# Altium project DE-100224.PrjPcb
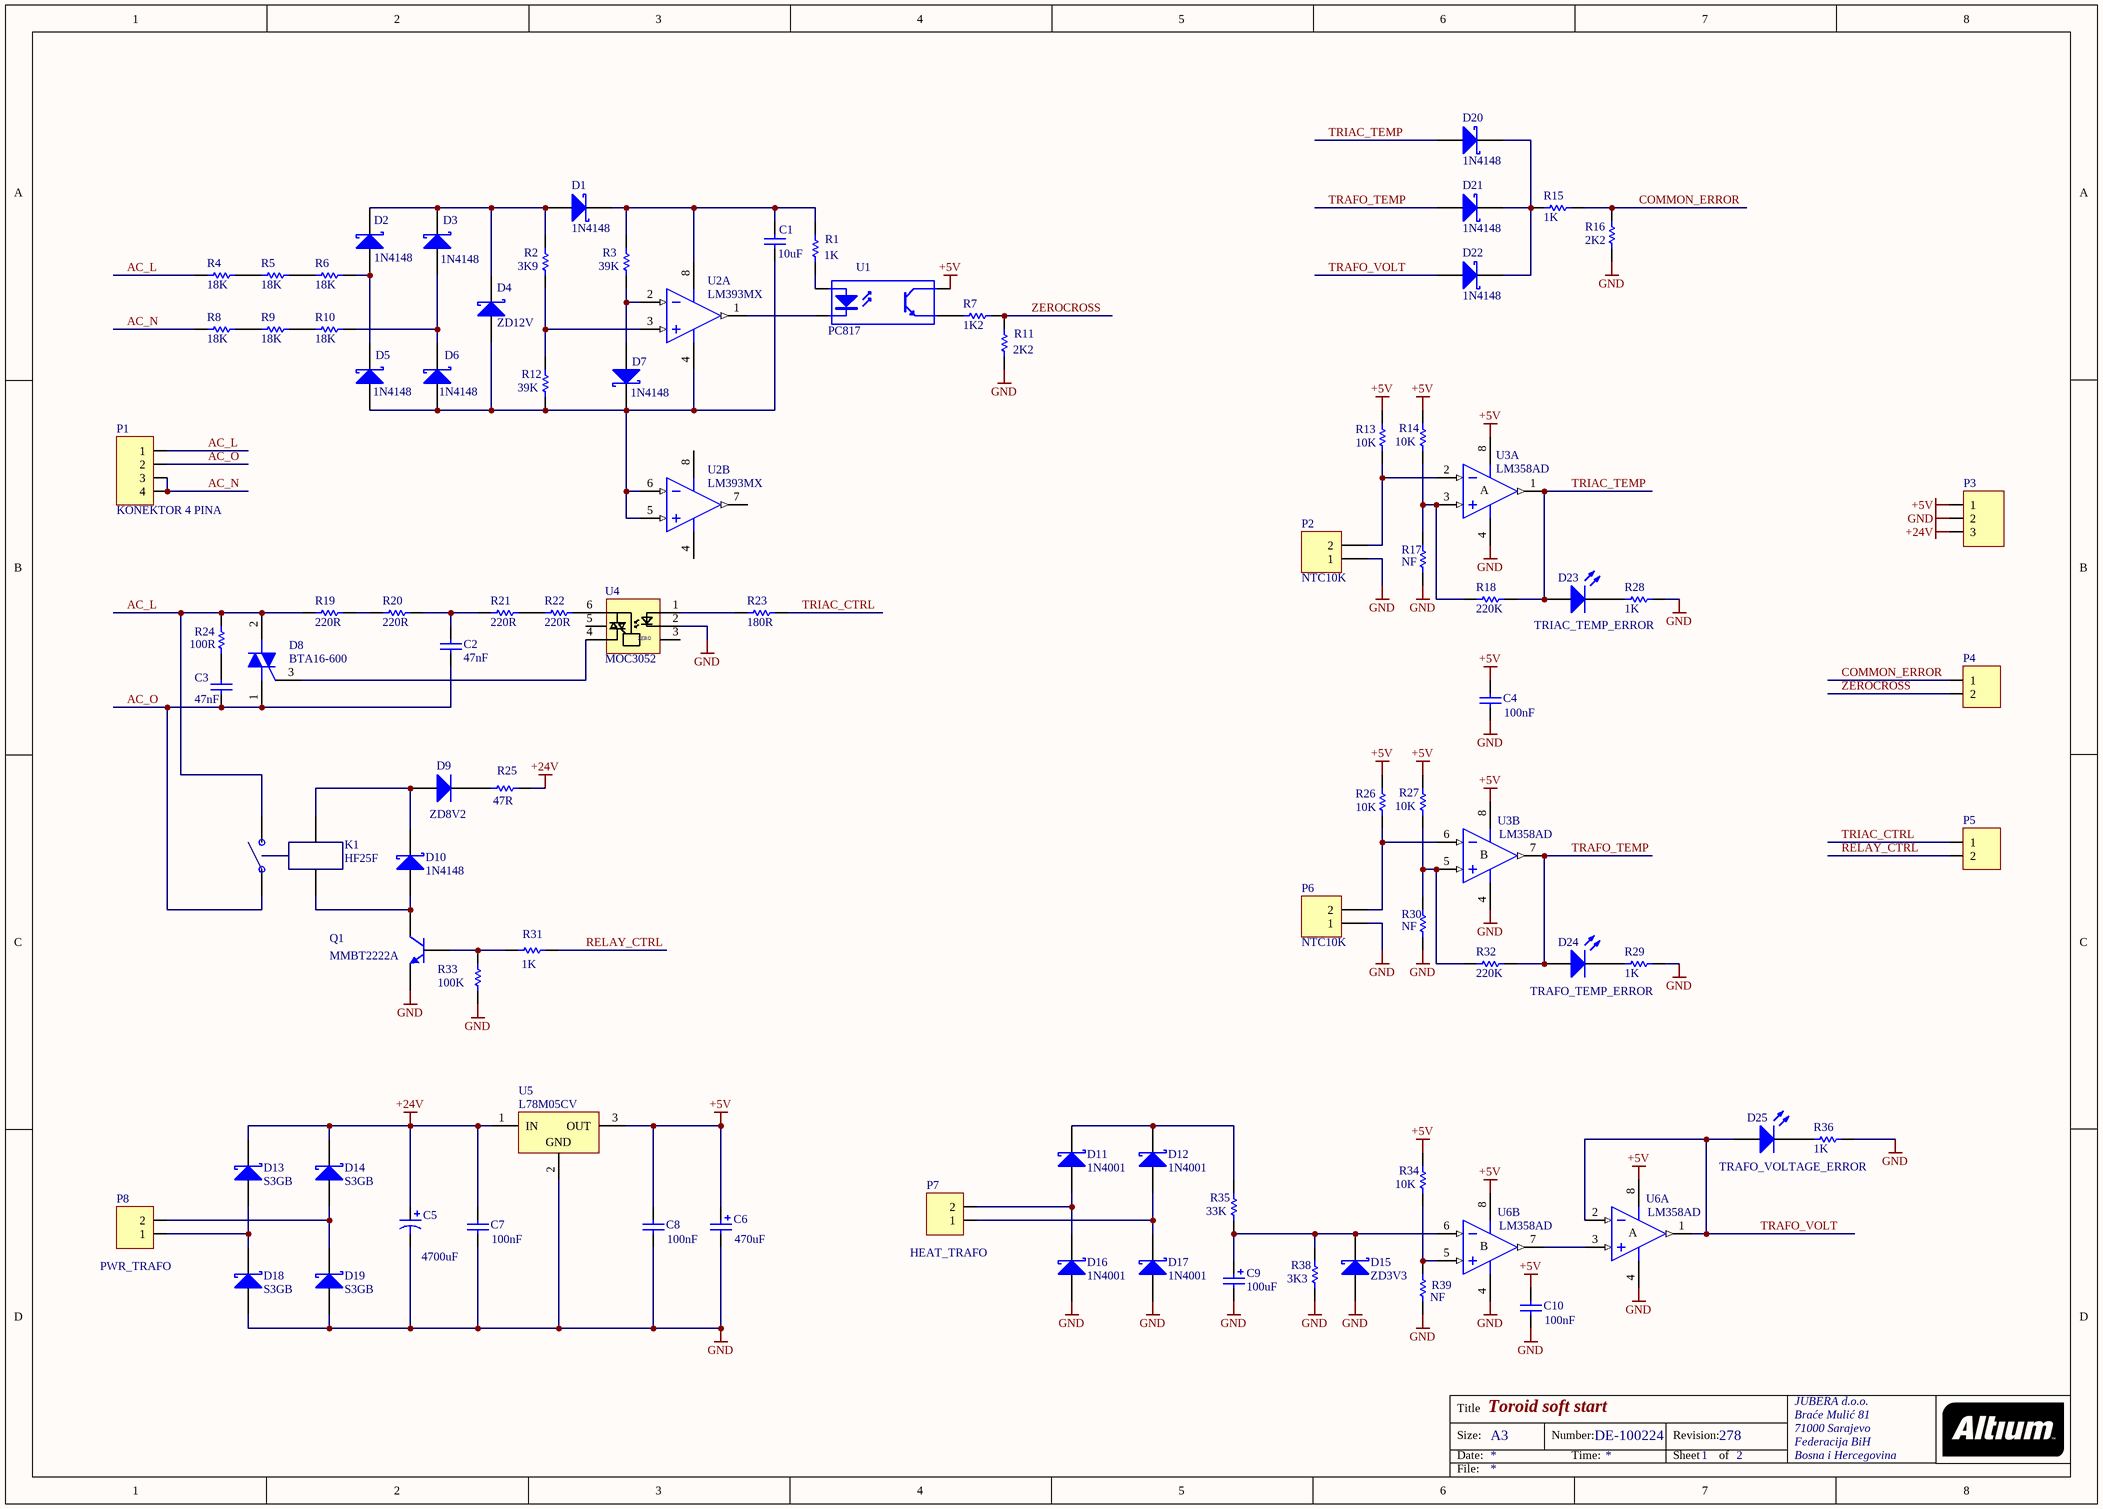
[diagram p0: DE-100224_01.SchDoc]
1 sheet, 89 parts. Net scope: global (net labels, ports and power ports of the same name join across sheets).
Board file: DE-100224.PcbDoc

## Sheet DE-100224_01.SchDoc: Toroid soft start
size A3; Author: eldar6776@hotmail.com; DrawnBy: Eldar Dedic; Organization: JUBERA d.o.o.; Address1: Braće Mulić 81; Address2: 71000 Sarajevo; Address3: Federacija BiH; Address4: Bosna i Hercegovina; DocumentNumber: DE-100224; Revision: 278; SheetNumber: 1; SheetTotal: 2

### Parts
C1  10uF  [0805]
C2  47nF  [X2 CAP]
C3  47nF  [X2 CAP]
C4  100nF  [0603]
C5  4700uF  [CAPPR5-13X25]
C6  470uF  [CAPPR5-10X16]
C7  100nF  [0603]
C8  100nF  [0603]
C9  100uF  [CAPPR2-5X11]
C10  100nF  [0603]
D1  1N4148  [SOD323]
D2  1N4148  [SOD323]
D3  1N4148  [SOD323]
D4  ZD12V  [SMB]
D5  1N4148  [SOD323]
D6  1N4148  [SOD323]
D7  1N4148  [SOD323]
D8  BTA16-600  [ONSC-TO-220-3-221A-07]
D9  ZD8V2  [DO-41]
D10  1N4148  [SOD323]
D11  1N4001  [SMB]
D12  1N4001  [SMB]
D13  S3GB  [SMB]
D14  S3GB  [SMB]
D15  ZD3V3  [SOD323]
D16  1N4001  [SMB]
D17  1N4001  [SMB]
D18  S3GB  [SMB]
D19  S3GB  [SMB]
D20  1N4148  [SOD323]
D21  1N4148  [SOD323]
D22  1N4148  [SOD323]
D23  TRIAC_TEMP_ERROR  [1.6X0.8X0.8]
D24  TRAFO_TEMP_ERROR  [1.6X0.8X0.8]
D25  TRAFO_VOLTAGE_ERROR  [1.6X0.8X0.8]
K1  HF25F  [HF25F]
P1  KONEKTOR 4 PINA  [KONEKTOR 4 PINA]
P2  NTC10K  [HDR1X2]
P3  (no value)  [TERMINAL BLOK 3]
P4  (no value)  [TERMINAL BLOK 2]
P5  (no value)  [TERMINAL BLOK 2]
P6  NTC10K  [HDR1X2]
P7  HEAT_TRAFO  [KONEKTOR 2 PINA]
P8  PWR_TRAFO  [KONEKTOR 2 PINA]
Q1  MMBT2222A  [SOT23_N]
R1  1K  [ERA-0603]
R2  3K9  [ERA-0603]
R3  39K  [ERA-0603]
R4  18K  [ERA-0805]
R5  18K  [ERA-0805]
R6  18K  [ERA-0805]
R7  1K2  [ERA-0603]
R8  18K  [ERA-0805]
R9  18K  [ERA-0805]
R10  18K  [ERA-0805]
R11  2K2  [ERA-0603]
R12  39K  [ERA-0603]
R13  10K  [ERA-0603]
R14  10K  [ERA-0603]
R15  1K  [ERA-0603]
R16  2K2  [ERA-0603]
R17  NF  [ERA-0603]
R18  220K  [ERA-0603]
R19  220R  [ERA-0805]
R20  220R  [ERA-0805]
R21  220R  [ERA-0805]
R22  220R  [ERA-0805]
R23  180R  [ERA-0603]
R24  100R  [1W100R]
R25  value 47R  [AXIAL-0.3]  (hidden comment: Res1)
R26  10K  [ERA-0603]
R27  10K  [ERA-0603]
R28  1K  [ERA-0603]
R29  1K  [ERA-0603]
R30  NF  [ERA-0603]
R31  1K  [ERA-0603]
R32  220K  [ERA-0603]
R33  100K  [ERA-0603]
R34  10K  [ERA-0603]
R35  33K  [ERA-0603]
R36  1K  [ERA-0603]
R38  3K3  [ERA-0603]
R39  NF  [ERA-0603]
U1  PC817  [DIP-4]
U2  LM393MX  [M08A_N]  (parts A,B of 2)
U3  LM358AD  [SO8_N]  (parts A,B of 2)
U4  MOC3052  [DIP6]
U5  L78M05CV  [TO220]
U6  LM358AD  [SO8_N]  (parts A,B of 2)

### Nets
+5V: C4.2 C6.1 C8.2 C10.2 P3.1 R13.2 R14.2 R26.2 R27.2 R34.2 U1.4(C) U3.8(V+) U5.3(OUT) U6.8(V+)
+24V: C5.1 C7.2 D13.2(K) D14.2(K) P3.3 R25.2 U5.1(IN)
GND: C4.1 C5.2 C6.2 C7.1 C8.1 C9.2 C10.1 D15.2(A) D16.1(A) D17.1(A) D18.1(A) D19.1(A) P2.1 P3.2 P6.1 Q1.2(E) R11.1 R16.1 R17.1 R28.1 R29.1 R30.1 R33.1 R36.1 R38.1 R39.1 U3.4(V-) U4.2 U5.2(GND) U6.4(V-)
AC_L: D8.2(MT2) K1.4 P1.1 R4.1 R19.1 R24.2
AC_N: P1.3 P1.4 R8.1
AC_O: C2.1 C3.1 D8.1(MT1) K1.3 P1.2
COMMON_ERROR: P4.1 R15.1 R16.2
RELAY_CTRL: P5.2 R31.1
TRAFO_TEMP: D21.2(A) D24.1(A) R32.1 U3.7(OUT)
TRAFO_VOLT: D22.2(A) D25.1(A) U6.1(OUT) U6.2(IN-)
TRIAC_CTRL: P5.1 R23.1
TRIAC_TEMP: D20.2(A) D23.1(A) R18.1 U3.1(OUT)
ZEROCROSS: P4.2 R7.1 R11.2
NetC1_1: C1.1 D4.1(A) D5.2(A) D6.2(A) D7.1(K) R12.1 U2.4(GND) U2.5(INB+) U2.6(INB-)
NetC1_2: C1.2 D1.1(K) R1.2 R3.2 U2.8(V+)
NetC2_2: C2.2 R20.2 R21.1
NetC3_2: C3.2 R24.1
NetC9_1: C9.1 D15.1(K) R35.1 R38.2 U6.6(IN-)
NetD1_2: D1.2(A) D2.1(K) D3.1(K) D4.2(K) R2.2
NetD2_2: D2.2(A) D5.1(K) R6.2
NetD3_2: D3.2(A) D6.1(K) R10.2
NetD7_2: D7.2(A) R3.1 U2.2(INA-)
NetD8_3: D8.3(G) U4.4
NetD9_1: D9.1(A) D10.1(K) K1.2
NetD9_2: D9.2(K) R25.1
NetD10_2: D10.2(A) K1.1 Q1.3(C)
NetD11_1: D11.1(A) D16.2(K) P7.2
NetD11_2: D11.2(K) D12.2(K) R35.2
NetD12_1: D12.1(A) D17.2(K) P7.1
NetD13_1: D13.1(A) D18.2(K) P8.1
NetD14_1: D14.1(A) D19.2(K) P8.2
NetD20_1: D20.1(K) D21.1(K) D22.1(K) R15.2
NetD23_2: D23.2(K) R28.2
NetD24_2: D24.2(K) R29.2
NetD25_2: D25.2(K) R36.2
NetP2_2: P2.2 R13.1 U3.2(IN-)
NetP6_2: P6.2 R26.1 U3.6(IN-)
NetQ1_1: Q1.1(B) R31.2 R33.2
NetR1_1: R1.1 U1.1(A)
NetR2_1: R2.1 R12.2 U2.3(INA+)
NetR4_2: R4.2 R5.1
NetR5_2: R5.2 R6.1
NetR7_2: R7.2 U1.3(E)
NetR8_2: R8.2 R9.1
NetR9_2: R9.2 R10.1
NetR14_1: R14.1 R17.2 R18.2 U3.3(IN+)
NetR19_2: R19.2 R20.1
NetR21_2: R21.2 R22.1
NetR22_2: R22.2 U4.6
NetR23_2: R23.2 U4.1
NetR27_1: R27.1 R30.2 R32.2 U3.5(IN+)
NetR34_1: R34.1 R39.2 U6.5(IN+)
NetU1_2: U1.2(K) U2.1(OUTA)
NetU6_3: U6.3(IN+) U6.7(OUT)

Not connected (* = marked no-connect by the designer): U2 7(OUTB); U4 3 5

### Notes on the sheet
- Title
- Size:
- Date:
- A3
- Number:
- Time:
- Revision:
- Sheet
- of
- File:
- (in symbol LM358AD, part A) A
- (in symbol LM358AD, part B) B
- (in symbol MOC3081) ZERO

### Library data of the parts
C1 = C0805: Ceramic Chip Capacitor - Standard; Note: Footprint corresponds to dimensions for bulk cassette packaging. This case size has tightened tolerances.; Published: 17-Jul-2002; LatestRevisionDate: 19-Mar-2004; LatestRevisionNote: Silkscreen size reduced.; DatasheetDocument: Mar-2001; PackageDocument: Mar-2001; PackageReference: 0805; Publisher: Altium Limited; Code_JEITA: 0805; Code_IPC: 2012[0805]; ComponentLink1Description: Manufacturer Link; ComponentLink1URL: http://www.kemet.com/; ComponentLink2Description: Datasheet; ComponentLink2URL: http://www.kemet.com/kemet/web/homepage/kechome.nsf/vapubfilesname/F3102TA.pdf/$file/F3102TA.pdf; Value: 10uF
C2 C3 = CAP X2: X2 275VAC capaitor
C4 C7 C8 C10 = C0603: Ceramic Chip Capacitor - Standard; Note: Footprint corresponds to dimensions for bulk cassette packaging. This case size has tightened tolerances.; Published: 17-Jul-2002; LatestRevisionDate: 19-Mar-2004; LatestRevisionNote: Silkscreen size reduced.; DatasheetDocument: Mar-2001; PackageDocument: Mar-2001; PackageReference: 0603; Publisher: Altium Limited; Code_JEITA: 0603; Code_IPC: 1608 [0603]; ComponentLink1Description: Manufacturer Link; ComponentLink1URL: http://www.kemet.com/; ComponentLink2Description: Datasheet; ComponentLink2URL: http://www.kemet.com/kemet/web/homepage/kechome.nsf/vapubfilesname/F3102TA.pdf/$file/F3102TA.pdf; Value: 100nF
C5 = EKA00GG447C00: Aluminum Electrolytic Capacitor, Radial Style with Long Leads: 4700uF, 10V; Note: Refer to Manufacturer's Data Sheets for other lead formations; DrillSize: Nominal, Rounded To The Nearest 0.1mm; Published: 19-Mar-2004; DatasheetDocument: 20-Feb-2001; PackageReference: CAPPR5-13X25; Publisher: Altium Limited; ComponentLink1Description: Manufacturer Link; ComponentLink1URL: http://www.vishay.com/; ComponentLink2Description: Datasheet; ComponentLink2URL: http://www.vishay.com/docs/25014/eka.pdf; Value: 4700uF
C6 = EKA00DD347F00: Aluminum Electrolytic Capacitor, Radial Style with Long Leads: 470uF, 35V; Note: Refer to Manufacturer's Data Sheets for other lead formations; DrillSize: Nominal, Rounded To The Nearest 0.1mm; Published: 19-Mar-2004; DatasheetDocument: 20-Feb-2001; PackageReference: CAPPR5-10X16; Publisher: Altium Limited; ComponentLink1Description: Manufacturer Link; ComponentLink1URL: http://www.vishay.com/; ComponentLink2Description: Datasheet; ComponentLink2URL: http://www.vishay.com/docs/25014/eka.pdf; Value: 470uF
C9 = EKA00AA247F00: Aluminum Electrolytic Capacitor, Radial Style with Long Leads: 47uF, 35V; Note: Refer to Manufacturer's Data Sheets for other lead formations; DrillSize: Nominal, Rounded To The Nearest 0.1mm; Published: 19-Mar-2004; DatasheetDocument: 20-Feb-2001; PackageReference: CAPPR2-5X11; Publisher: Altium Limited; ComponentLink1Description: Manufacturer Link; ComponentLink1URL: http://www.vishay.com/; ComponentLink2Description: Datasheet; ComponentLink2URL: http://www.vishay.com/docs/25014/eka.pdf; Value: 47uF
D1-D3 D5-D7 D10 D15 D20-D22 = 1PS76SB10: Schottky Barrier Diode; Published: 17-Sep-2003; LatestRevisionDate: 19-Mar-2004; LatestRevisionNote: Silkscreen size reduced.; DatasheetVersion: 14-Oct-1996; PackageVersion: May-1999; PackageReference: SOD323; Publisher: Altium Limited; PackageDescription: SOD-323/SC-76; 2 Leads; Body 1.7 x 1.3 mm, (LxW); ComponentLink1Description: Manufacturer Link; ComponentLink1URL: http://www.semiconductors.philips.com/; ComponentLink2Description: Datasheet; ComponentLink2URL: http://www.semiconductors.philips.com/acrobat/datasheets/1PS76SB10_2.pdf
D4 = 10BQ100: Schottky Rectifier; Published: 8-Jun-2000; LatestRevisionDate: 17-Jul-2002; LatestRevisionNote: Re-released for DXP Platform.; DatasheetVersion: PD-2.437A; PackageReference: SMB; Publisher: Altium Limited; PackageDescription: DO-214-AA/SMB; 2 C-Bend Leads; Body 5.3 x 3.6 mm, inc. leads (LxW); ComponentLink1Description: Manufacturer Link; ComponentLink1URL: http://www.irf.com/; ComponentLink2Description: Datasheet; ComponentLink2URL: http://www.irf.com/product-info/datasheets/data/10bq100.pdf
D8 = BTA08-600BW3G: Triacs, Silicon Bidirectional Thyristor, 3-Pin TO-220, Pb-Free, Tube; Manufacturer: On Semiconductor; IGT Max (mA): 50; IT(RMS) Max (A): 8; ITSM Max (A): 90; DatasheetVersion: Rev. 1; PackageVersion: Rev. O, 07/2008; PackageReference: TO-220-3-221A-07; PackageDescription: 3-Pin Flange Mount, Vertical Straight Lead, Body 9.97 x 4.445 mm, Pitch 2.54 mm; Supplier 1: Digi-Key; Supplier Part Number 1: BTA08-600BW3G-ND; Supplier 2: Newark; Supplier Part Number 2: 13P2072; Supplier 3: Mouser; Supplier Part Number 3: 863-BTA08-600BW3G; Packing: Tube; RoHS: Pb-Free; Mounting Technology: Through Hole; PartNumber: BTA08-600BW3G; ComponentLink1Description: Manufacturer URL; ComponentLink1URL: http://www.onsemi.com/; ComponentLink2Description: Datasheet; ComponentLink2URL: http://www.onsemi.com/pub_link/Collateral/BTA08-600BW3-D.PDF; ComponentLink3Description: Package Specification; ComponentLink3URL: http://www.onsemi.com/pub_link/Collateral/221A-07.PDF
D9 = 1N4003: 1.0 Ampere General Purpose Rectifier; Published: 8-Jun-2000; LatestRevisionDate: 17-Jul-2002; LatestRevisionNote: Re-released for DXP Platform.; DatasheetDocument: 1998; PackageDocument: Aug-1999; PackageReference: DO-41; Publisher: Altium Limited; Code_JEDEC: DO-204-AL; ComponentLink1Description: Manufacturer Link; ComponentLink1URL: http://www.fairchildsemi.com/; ComponentLink2Description: Pinout Specification; ComponentLink2URL: http://www.fairchildsemi.com/ds/1N%2F1N4001.pdf
D11-D14 D16-D19 = D Schottky: Schottky Diode; Published: 8-Jun-2000; LatestRevisionDate: 17-Jul-2002; LatestRevisionNote: Re-released for DXP Platform.; PackageReference: SMB; Publisher: Altium Limited; PackageDescription: DO-214-AA/SMB; 2 C-Bend Leads; Body 5.3 x 3.6 mm, inc. leads (LxW); Code_JEDEC: DO-214-AA
D23-D25 = HSMB-C190: Blue Surface Mount Chip LED, Blue; LuminousIntensity: 1.6mcd (Minimum).; PCB_Layout: Complies with manufacturer's recommendation.; Published: 11-Dec-2002; DatasheetVersion: 26-Feb-2002; PackageVersion: Mar-2002; PackageReference: 1.6X0.8X0.8; Publisher: Altium Limited; PackageDescription: SM LED; 2 Flat Leads; LED_Colour: Blue; ComponentLink1Description: Manufacturer Link; ComponentLink1URL: http://www.avagotech.com/; ComponentLink2Description: Datasheet; ComponentLink2URL: http://cp.literature.agilent.com/litweb/pdf/5988-5211EN.pdf
K1 = HF25F: PCB relay 250VAC/20A 30VDC/16A
P1 = KONEKTOR 4 PINA: Razdvojivi konektor 4 pina
P2 P6 = Header 2: Header, 2-Pin; LatestRevisionDate: 17-Jul-2002; LatestRevisionNote: Re-released for DXP Platform.; Publisher: Altium Limited
P3 = TERMINAL BLOK 3: 3 pinski terminal blok konektor
P4 P5 = TERMINAL BLOK 2: Terminal blok konektor 3,5 mm
P7 P8 = KONEKTOR 2 PINA: Razdvojivi konetor 2 pina
Q1 = BC817: NPN General-purpose Transistor; Published: 17-Sep-2003; LatestRevisionDate: 12-Dec-2006; LatestRevisionNote: IPC-7351 Footprint Added.; DatasheetVersion: Jun-1999; PackageVersion: May-1999; PackageReference: SOT23; Publisher: Altium Limited; PackageDescription: 3-Pin SOT-23 Package 0.95 mm Pitch, 2.3 mm Lead Span; ComponentLink1Description: Manufacturer Link; ComponentLink1URL: http://www.semiconductors.philips.com/; ComponentLink2Description: Datasheet; ComponentLink2URL: http://www.semiconductors.philips.com/acrobat/datasheets/BC817_BC817W_BC337_5.pdf
R1-R3 R7 R11-R18 R23 R26-R36 R38 R39 = ERAV: Metal Film Thermosensitive Chip Resistor, 0.56 Ohm to 10k Ohm Range, 5% Tolerance, 0603 Size, 0.063 W; Note: If flow soldering, adjust pad width of PCB Footprint to 0.7 - 0.8 times the width of the resistor.; Published: 17-Dec-2003; LatestRevisionDate: 19-Mar-2004; LatestRevisionNote: Silkscreen size reduced.; PackageDocument: Mar-2003; PackageReference: ERA-0603; Publisher: Altium Limited; Code_IPC: 1608 [0603]; ComponentLink1Description: Manufacturer Link; ComponentLink1URL: http://www.panasonic.com/industrial/components/resistive_products.htm; ComponentLink2Description: Datasheet; ComponentLink2URL: http://www.panasonic.com/industrial/components/pdf/AOF0000CE1.pdf
R4-R6 R8-R10 R19-R22 = ERAS: Metal Film Thermosensitive Chip Resistor, 0.56 Ohm to 10k Ohm Range, 5% Tolerance, 0805 Size, 0.1 W; Note: If flow soldering, adjust pad width of PCB Footprint to 0.7 - 0.8 times the width of the resistor.; Published: 17-Dec-2003; LatestRevisionDate: 19-Mar-2004; LatestRevisionNote: Silkscreen size reduced.; PackageDocument: Mar-2003; PackageReference: ERA-0805; Publisher: Altium Limited; Code_IPC: 2012 [0805]; ComponentLink1Description: Manufacturer Link; ComponentLink1URL: http://www.panasonic.com/industrial/components/resistive_products.htm; ComponentLink2Description: Datasheet; ComponentLink2URL: http://www.panasonic.com/industrial/components/pdf/AOF0000CE1.pdf
R24 = 1W100R: Carbon F 1W resistor; Published: 17-Dec-2003; PackageReference: RD6.35x2.3; Publisher: Altium Limited; ComponentLink1Description: Manufacturer Link; ComponentLink1URL: http://www.panasonic.com/industrial/components/resistive_products.htm; ComponentLink2Description: Datasheet; ComponentLink2URL: http://www.panasonic.com/industrial/components/pdf/AOA0000CE12.pdf
R25 = Res1: Resistor; Published: 8-Jun-2000; LatestRevisionDate: 17-Jul-2002; LatestRevisionNote: Re-released for DXP Platform.; PackageReference: AXIAL-0.3; Publisher: Altium Limited; PackageDescription: Axial Device, Thru-Hole; 2 Leads; 0.3 in Pin Spacing
U1 = PC817: 4-Pin Phototransistor Optocoupler; Published: 24-Mar-1999; LatestRevisionDate: 04-Mar-2005; LatestRevisionNote: Sch pins 3 & 4 Swapped.; DatasheetVersion: Nov-2003; PackageReference: DIP-4; Publisher: Altium Limited
U2 = LM393MX: Low Power Low Offset Voltage Dual Comparator, 8-pin Narrow SOIC; Manufacturer: National Semiconductor; PackageTopMarking: NSZXTT*LM*393M; PowerWise: N; High-Reliability: Y; DatasheetVersion: Aug-2002; PackageVersion: revM, May-2009; PackageReference: M08A; PackageDescription: SOIC Narrow, 4.9 x 3.9 x 1.45mm, 8 Lead, 1.27mm Pitch; PartNumber: LM393MX; RoHS: N; PinCount: 8; CompType: Comparator; Code_JEDEC: MS-012-AA; Code_IPC: SOIC127P600-8; ComponentLink1Description: Manufacturer URL; ComponentLink1URL: http://www.national.com/; ComponentLink2Description: LM393 Datasheet; ComponentLink2URL: http://www.national.com/ds/LM/LM393.pdf; ComponentLink3Description: LM393 Web Page; ComponentLink3URL: http://www.national.com/pf/LM/LM393.html; ComponentLink4Description: M08A Package Page; ComponentLink4URL: http://www.national.com/packaging/folders/m08a.html
U3 U6 = LM358AD: Low-Power Dual Operational Amplifier; Published: 24-Aug-2001; LatestRevisionDate: 13-Apr-2006; LatestRevisionNote: IPC-7351 Footprint Added.; DatasheetVersion: Jun-1998; PackageVersion: Dec-2002; PackageReference: SO8; Publisher: Altium Limited; PackageDescription: 8-Pin Small Outline Integrated Circuit 1.27 mm Pitch; Code_JEDEC: MS-012-AA; Code_IPC: SOIC127P600-8; ComponentLink1Description: Manufacturer Link; ComponentLink1URL: http://www.st.com/; ComponentLink2Description: Datasheet; ComponentLink2URL: http://www.st.com/stonline/products/literature/ds/2163/lm358.pdf
U4 = MOC3081: Zero-Cross Optoisolator Triac Driver
U5 = L78M05CV: Positive Voltage Regulator, 5V, 3-Pin TO-220; DatasheetVersion: Nov-2010; PackageVersion: ver3.0; PackageReference: TO220; PackageDescription: TO, Thru-Hole, Vertical, Heatsink Mounted; 3 In-Line Leads; Pitch 2.54 mm; PartNumber: L78M05CV; ComponentLink1Description: Manufacturer URL; ComponentLink1URL: http://www.st.com; ComponentLink2Description: Datasheet; ComponentLink2URL: http://www.st.com/internet/com/TECHNICAL_RESOURCES/TECHNICAL_LITERATURE/DATASHEET/CD00000447.pdf; ComponentLink3Description: Package Specification; ComponentLink3URL: http://www.st.com/internet/com/TECHNICAL_RESOURCES/TECHNICAL_LITERATURE/PACKAGE_INFORMATION/CD00004649.pdf